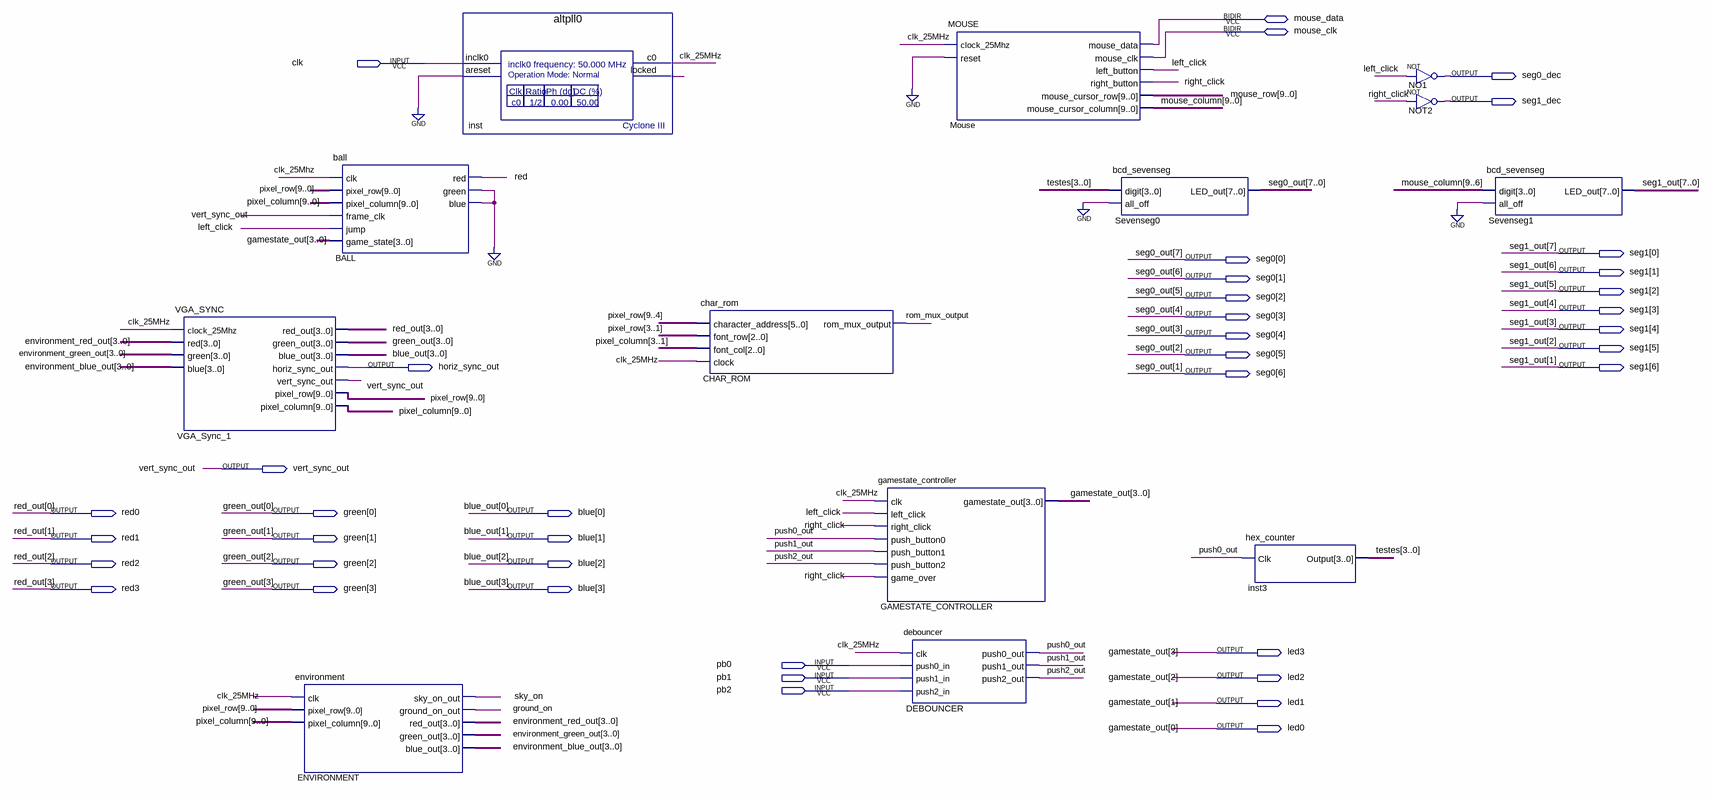
[diagram p0: schematic sheet]
// Quartus schematic 305_miniproject_Cecil.bdf as structural Verilog: 13 symbols, 40 pins
module \305_miniproject_Cecil  (
  input  clk,
  input  pb0,
  input  pb1,
  input  pb2,
  inout  mouse_data,
  inout  mouse_clk,
  output seg0_dec,
  output seg1_dec,
  output [6:0] seg1,
  output [6:0] seg0,
  output horiz_sync_out,
  output vert_sync_out,
  output red0,
  output [3:0] green,
  output [3:0] blue,
  output red1,
  output red2,
  output red3,
  output led3,
  output led2,
  output led1,
  output led0
);

  wire BALL_green, clk_25MHz, ground_on, inst_locked, left_click, push0_out, push1_out, push2_out, red,
       right_click, rom_mux_output, sky_on;
  wire [0:0] seg0_out, seg1_out;
  wire [3:0] environment_blue_out, environment_green_out, environment_red_out, testes;
  wire [9:0] mouse_column, mouse_row, pixel_column, pixel_row;

  VGA_SYNC VGA_Sync_1 (
    .clock_25Mhz(clk_25MHz), .red(environment_red_out), .green(environment_green_out),
    .blue(environment_blue_out), .red_out({red3, red2, red1, red0}), .green_out(green), .blue_out(blue),
    .horiz_sync_out(horiz_sync_out), .vert_sync_out(vert_sync_out), .pixel_row(pixel_row),
    .pixel_column(pixel_column));
  ball BALL (
    .clk(clk_25MHz), .pixel_row(pixel_row), .pixel_column(pixel_column), .frame_clk(vert_sync_out),
    .jump(left_click), .game_state({led3, led2, led1, led0}), .red(red), .green(BALL_green), .blue(BALL_green));
  environment ENVIRONMENT (
    .clk(clk_25MHz), .pixel_row(pixel_row), .pixel_column(pixel_column), .sky_on_out(sky_on),
    .ground_on_out(ground_on), .red_out(environment_red_out), .green_out(environment_green_out),
    .blue_out(environment_blue_out));
  altpll0 inst (.inclk0(clk), .areset(1'b0), .c0(clk_25MHz), .locked(inst_locked));
  char_rom CHAR_ROM (
    .character_address(pixel_row[9:4]), .font_row(pixel_row[3:1]), .font_col(pixel_column[3:1]),
    .clock(clk_25MHz), .rom_mux_output(rom_mux_output));
  gamestate_controller GAMESTATE_CONTROLLER (
    .clk(clk_25MHz), .left_click(left_click), .right_click(right_click), .push_button0(push0_out),
    .push_button1(push1_out), .push_button2(push2_out), .game_over(right_click),
    .gamestate_out({led3, led2, led1, led0}));
  MOUSE Mouse (
    .clock_25Mhz(clk_25MHz), .reset(1'b0), .left_button(left_click), .right_button(right_click),
    .mouse_cursor_row(mouse_row), .mouse_cursor_column(mouse_column), .mouse_data(mouse_data),
    .mouse_clk(mouse_clk));
  debouncer DEBOUNCER (
    .clk(clk_25MHz), .push0_in(pb0), .push1_in(pb1), .push2_in(pb2), .push0_out(push0_out),
    .push1_out(push1_out), .push2_out(push2_out));
  bcd_sevenseg Sevenseg0 (
    .digit(testes), .all_off(1'b0),
    .LED_out({seg0[0], seg0[1], seg0[2], seg0[3], seg0[4], seg0[5], seg0[6], seg0_out[0]}));
  hex_counter inst3 (.Clk(push0_out), .Output(testes));
  not NO1 (seg0_dec, left_click);
  not NOT2 (seg1_dec, right_click);
  bcd_sevenseg Sevenseg1 (
    .digit(mouse_column[9:6]), .all_off(1'b0),
    .LED_out({seg1[0], seg1[1], seg1[2], seg1[3], seg1[4], seg1[5], seg1[6], seg1_out[0]}));
  // also tied to GND on the sheet: BALL_green

  // Other names for the same wires on the sheet: blue_out[3:0] = blue; gamestate_out[3:0] = {led3, led2, led1, led0};
  //   green_out[3:0] = green; red_out[3:0] = {red3, red2, red1, red0};
  //   seg0_out[7:1] = {seg0[0], seg0[1], seg0[2], seg0[3], seg0[4], seg0[5], seg0[6]};
  //   seg1_out[7:1] = {seg1[0], seg1[1], seg1[2], seg1[3], seg1[4], seg1[5], seg1[6]}
endmodule
